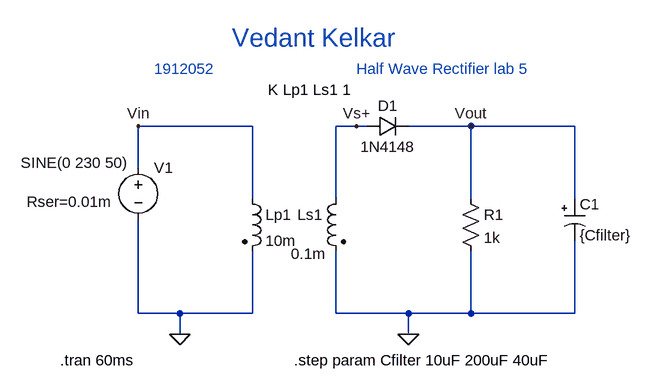
[diagram p0: schematic Draft17.asc]
Draft17.asc, the LTspice schematic file:
Version 4
SHEET 1 880 680
WIRE 80 32 -96 32
WIRE 240 32 208 32
WIRE 256 32 240 32
WIRE 416 32 320 32
WIRE 576 32 416 32
WIRE -96 96 -96 32
WIRE 80 144 80 32
WIRE 208 144 208 32
WIRE 416 144 416 32
WIRE 576 144 576 32
WIRE -96 320 -96 176
WIRE -32 320 -96 320
WIRE 80 320 80 224
WIRE 80 320 -32 320
WIRE 208 320 208 224
WIRE 320 320 208 320
WIRE 416 320 416 224
WIRE 416 320 320 320
WIRE 576 320 576 208
WIRE 576 320 416 320
WIRE -32 352 -32 320
WIRE 320 352 320 320
FLAG -32 352 0
FLAG -96 32 Vin
FLAG 240 32 Vs+
FLAG 416 32 Vout
FLAG 320 352 0
SYMBOL voltage -96 80 R0
WINDOW 3 -181 8 Left 2
WINDOW 123 0 0 Left 0
WINDOW 39 -172 68 Left 2
SYMATTR Value SINE(0 230 50)
SYMATTR SpiceLine Rser=0.01m
SYMATTR InstName V1
SYMBOL diode 256 48 R270
WINDOW 0 32 32 VTop 2
WINDOW 3 0 32 VBottom 2
SYMATTR InstName D1
SYMATTR Value 1N4148
SYMBOL ind2 224 128 M0
WINDOW 3 31 100 Left 2
SYMATTR Value 0.1m
SYMATTR InstName Ls1
SYMATTR Type ind
SYMBOL ind2 64 128 R0
SYMATTR InstName Lp1
SYMATTR Value 10m
SYMATTR Type ind
SYMBOL res 400 128 R0
SYMATTR InstName R1
SYMATTR Value 1k
SYMBOL polcap 560 144 R0
WINDOW 3 24 56 Left 2
SYMATTR InstName C1
SYMATTR Value {Cfilter}
SYMATTR Description Capacitor
SYMATTR Type cap
SYMATTR SpiceLine V=6.3 Irms=0 Rser=4 Lser=0 mfg="AVX" pn="TAJA106M006" type="Tantalum"
TEXT 104 -24 Left 2 !K Lp1 Ls1 1
TEXT 144 392 Left 2 !.step param Cfilter 10uF 200uF 40uF
TEXT -216 392 Left 2 !.tran 60ms
TEXT 48 -104 Left 4 ;Vedant Kelkar
TEXT -72 -56 Left 2 ;1912052
TEXT 240 -56 Left 2 ;Half Wave Rectifier lab 5

The netlist it stands for:
* Draft17.asc
V1 Vin 0 SINE(0 230 50) Rser=0.01m
D1 Vs+ Vout 1N4148
Ls1 Vs+ 0 0.1m
Lp1 Vin 0 10m
R1 Vout 0 1k
C1 Vout 0 {Cfilter} V=6.3 Irms=0 Rser=4 Lser=0 mfg="AVX" pn="TAJA106M006" type="Tantalum"
.model D D
.lib standard.dio
K Lp1 Ls1 1
.step param Cfilter 10uF 200uF 40uF
.tran 60ms
* Vedant Kelkar
* 1912052
* Half Wave Rectifier lab 5
.backanno
.end